# Altium schematic sheet 1.4.SchDoc
size A3; SheetNumber: 4
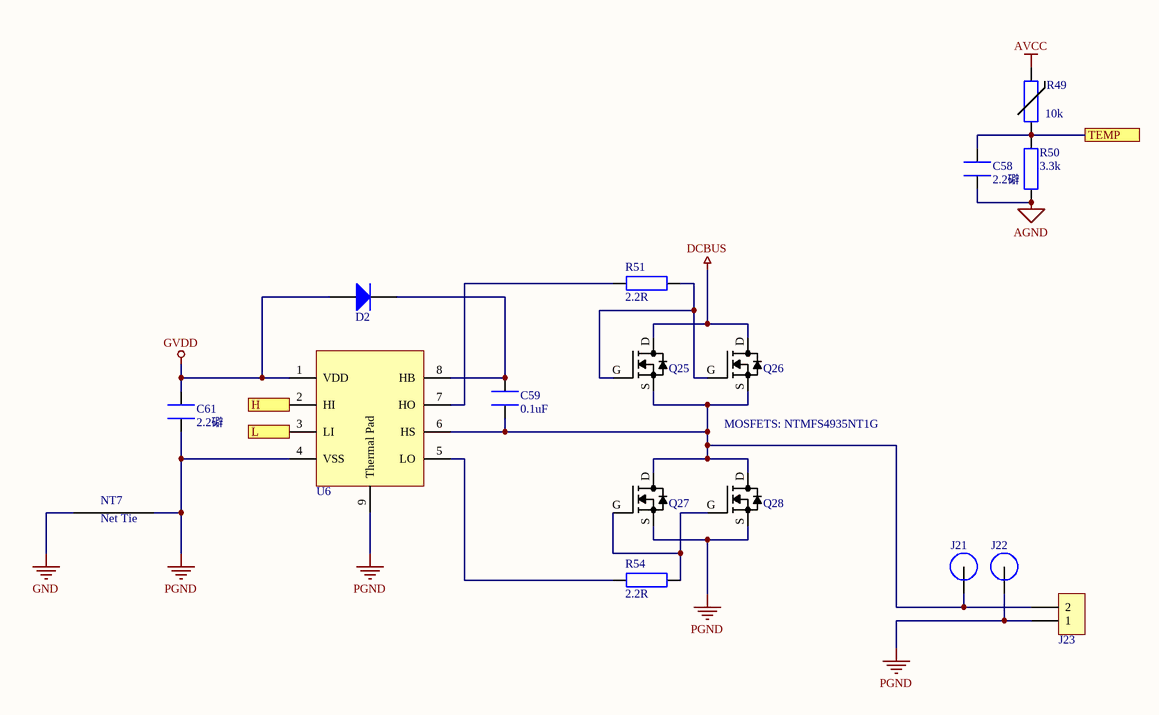
[diagram p0: 1.4.SchDoc]

## Parts
C58  2.2礔  [CAPC1608X09L]
C59  0.1uF  [CAPC1608X09L]
C61  2.2礔  [CAPC1608X09L]
D2  (no value)  [DIOM2717X10N]
J21  (no value)  [M3 Spade Hole]
J22  (no value)  [M3 Spade Hole]
J23  1868076  [1868076]  (value not drawn)
NT7  0.25mm  [NetTie_0.25mm]  (value not drawn)  (net tie, no BOM)
Q25  FILL_FOOTPRINT  [SO8FL_FILL]  (value not drawn)
Q26  (no value)  [SO8FL]
Q27  (no value)  [SO8FL]
Q28  (no value)  [SO8FL]
R49  10k  [RESC1005X40N]
R50  3.3k  [RESC1608X55N]
R51  2.2R  [RESC1608X55N]
R54  2.2R  [RESC1608X55N]
U6  (no value)  [SON80P400X80_HS-9N]

## Ports
H, L, TEMP

## Nets
AGND: C58.1 R50.2
AVCC: R49.2
DCBUS: Q25.D Q26.D
GND: NT7.1
GVDD: C61.2 D2.A U6.1(VDD)
PGND: C61.1 J22.1 J23.1 NT7.2 Q27.S Q28.S U6.4(VSS) U6.9(Thermal_Pad)
H: U6.2(HI) ; port H
L: U6.3(LI) ; port L
TEMP: C58.2 R49.1 R50.1 ; port TEMP
NetC59_1: C59.1 D2.K U6.8(HB)
NetC59_2: C59.2 J21.1 J23.2 Q25.S Q26.S Q27.D Q28.D U6.6(HS)
NetQ25_G: Q25.G Q26.G R51.2
NetQ27_G: Q27.G Q28.G R54.2
NetR51_1: R51.1 U6.7(HO)
NetR54_1: R54.1 U6.5(LO)

## Notes on the sheet
- MOSFETS: NTMFS4935NT1G
- (in symbol NetTie_0.25mm) Net Tie

## Library data of the parts
C58 C61 = GRM188R61C225KE15D: CAP CER 2.2UF 16V X5R 0603; Manufacturer: Murata Electronics North America; Tolerance: ?0%; Supplier 1: Digi-Key; Supplier Part Number 1: 490-3296-1-ND; Manufacturer Part Number: GRM188R61C225KE15D; RoHS: RoHS Compliant; Category: Capacitors; Stock 1: 1255740; Pricing 1: 1=0.12, 10=0.08, 50=0.046, 100=0.038, 250=0.032, 500=0.0268, 1000=0.022 (USD); Packaging: Cut Tape (CT); Capacitance: 2.2礔; Voltage - Rated: 16V; Temperature Coefficient: X5R; Mounting Type: Surface Mount, MLCC; Operating Temperature: -55癈 ~ 85癈; Applications: General Purpose; Ratings: -; Package / Case: 0603 (1608 Metric); Size / Dimension: 0.063" L x 0.031" W (1.60mm x 0.80mm); Height - Seated (Max): -; Thickness (Max): 0.035" (0.90mm); Lead Spacing: -; Features: -; Lead Style: -; ComponentLink1URL: http://www.murata.com/~/media/webrenewal/support/library/catalog/products/capacitor/mlcc/c02e.pdf; ComponentLink1Description: http://www.murata.com/~/media/webrenewal/support/library/catalog/products/capacitor/mlcc/c02e.pdf
C59 = GRM188R71H104KA93D: CAP CER 0.1UF 50V X7R 0603; Manufacturer: Murata Electronics North America; Tolerance: ?0%; Supplier 1: Digi-Key; Supplier Part Number 1: 490-1519-2-ND; Manufacturer Part Number: GRM188R71H104KA93D; RoHS: RoHS Compliant; Category: Capacitors; Pricing 1: 4000=0.01822, 8000=0.01663, 12000=0.01584 (USD); Packaging: Tape & Reel (TR); Capacitance: 0.1uF; Voltage - Rated: 50V; Temperature Coefficient: X7R; Mounting Type: Surface Mount, MLCC; Operating Temperature: -55癈 ~ 125癈; Applications: General Purpose; Ratings: -; Package / Case: 0603 (1608 Metric); Size / Dimension: 0.063" L x 0.032" W (1.60mm x 0.80mm); Height - Seated (Max): -; Thickness (Max): 0.035" (0.90mm); Lead Spacing: -; Features: -; Lead Style: -; ComponentLink1URL: http://www.murata.com/~/media/webrenewal/support/library/catalog/products/capacitor/mlcc/c02e.ashx?la=en-us; ComponentLink1Description: http://www.murata.com/~/media/webrenewal/support/library/catalog/products/capacitor/mlcc/c02e.ashx?la=en-us; Stock: 19812000; Part Status: Active; Supplier 2: Digi-Key; Supplier Part Number 2: 490-1519-1-ND; Pricing 2: 1=0.12, 10=0.084, 100=0.0396, 500=0.02778, 1000=0.023 (USD)
D2 = MBR140SFT1G: Rectifier Diode, Single, 40 V, 1 A, SOD-123FL, 2, 550 mV
J21 J22 = M3 Spade Terminal
J23 = 1868076: CONN TERM BLOCK 2POS 7.62MM; Manufacturer: Phoenix Contact; Number of Levels: 1; Positions Per Level: 2; Pitch: 0.300" (7.62mm); Mating Orientation: Horizontal with Board; Current: 30A; Voltage: 300V; Wire Gauge: 10-30 AWG; Wire Termination: Screw - Rising Cage Clamp; Torque - Screw: 0.5-0.6 Nm (4.4-5.3 Lb-In); Screw Thread: M3; Supplier 1: Digi-Key; Supplier Part Number 1: 277-5840-ND; RoHS: RoHS Compliant; Category: Connectors, Interconnects; Stock: 2175; Pricing 1: 1=1.56, 10=1.517, 50=1.4178, 100=1.3044, 250=1.20512, 500=1.14842, 1000=1.0564 (USD); Packaging: Bulk; Part Status: Active; Mounting Type: Through Hole; Features: Interlocking (Side); Color: Green; Operating Temperature: -; Housing Material: Polyamide (PA), Nylon; Contact Material - Plating: -; Clamp Material - Plating: -; Screw Material - Plating: -; ComponentLink1URL: http://media.digikey.com/PDF/Data%20Sheets/Phoenix%20Contact%20PDFs/1868076.pdf; ComponentLink1Description: http://media.digikey.com/PDF/Data%20Sheets/Phoenix%20Contact%20PDFs/1868076.pdf
NT7 = NetTie_0.25mm
Q25-Q28 = NTMFS4935NT1G: MOSFET N-CH 30V 13A SO8FL; Manufacturer: ON Semiconductor; FET Type: N-Channel; Current - Continuous Drain (Id) @ 25癈: 13A (Ta), 93A (Tc); Drive Voltage (Max Rds On,  Min Rds On): 4.5V, 10V; Vgs(th) (Max) @ Id: 2.2V @ 250礎; Gate Charge (Qg) (Max) @ Vgs: 49.4nC @ 10V; Input Capacitance (Ciss) (Max) @ Vds: 4850pF @ 15V; Vgs (Max): ?0V; Power Dissipation (Max): 930mW (Ta), 48W (Tc); Rds On (Max) @ Id, Vgs: 3.2 mOhm @ 30A, 10V; Supplier 1: Digi-Key; Supplier Part Number 1: NTMFS4935NT1GOSCT-ND; RoHS: RoHS Compliant; Category: Discrete Semiconductor Products; Stock 1: 932; Pricing 1: 1=0.61, 10=0.541, 100=0.4145, 500=0.3277 (USD); Packaging: Cut Tape (CT); Part Status: Active; Technology: MOSFET (Metal Oxide); Drain to Source Voltage (Vdss): 30V; FET Feature: -; Operating Temperature: -55癈 ~ 150癈 (TJ); Mounting Type: Surface Mount; Supplier Device Package: 5-DFN (5x6) (8-SOFL); Package / Case: 8-PowerTDFN, 5 Leads; ComponentLink1URL: http://www.onsemi.com/pub_link/Collateral/NTMFS4935N-D.PDF; ComponentLink1Description: http://www.onsemi.com/pub_link/Collateral/NTMFS4935N-D.PDF; Manufacturer Part Number: NTMFS4935NT1G
R49 = NCP15XH103F03RC: THERMISTOR 10K OHM NTC 0402 SMD; Value: 10k
R50 = RC0603FR-073K3L: RES SMD 3.3K OHM 1% 1/10W 0603; Manufacturer: Yageo; Tolerance: ?%; Power (Watts): 0.1W, 1/10W; Temperature Coefficient: ?00ppm/癈; Supplier 1: Digi-Key; Supplier Part Number 1: 311-3.30KHRCT-ND; Manufacturer Part Number: RC0603FR-073K3L; RoHS: RoHS Compliant; Category: Resistors; Stock 1: 420019; Pricing 1: 1=0.1, 10=0.014, 25=0.01, 100=0.0057, 250=0.00436, 500=0.00348, 1000=0.00257, 2500=0.00223 (USD); Packaging: Cut Tape (CT); Resistance (Ohms): 3.3k; Composition: Thick Film; Features: Moisture Resistant; Operating Temperature: -55癈 ~ 155癈; Package / Case: 0603 (1608 Metric); Supplier Device Package: 0603; Size / Dimension: 0.063" L x 0.031" W (1.60mm x 0.80mm); Height: 0.022" (0.55mm); Number of Terminations: 2; ComponentLink1URL: http://www.yageo.com/documents/recent/PYu-RC_Group_51_RoHS_L_04.pdf; ComponentLink1Description: http://www.yageo.com/documents/recent/PYu-RC_Group_51_RoHS_L_04.pdf
R51 R54 = RC0603FR-072R2L: RES SMD 2.2 OHM 1% 1/10W 0603; Manufacturer: Yageo; Resistance (Ohms): 2.2; Tolerance: ?%; Power (Watts): 0.1W, 1/10W; Temperature Coefficient: ?00ppm/癈; Supplier 1: Digi-Key; Supplier Part Number 1: 311-2.2HRCT-ND; Manufacturer Part Number: RC0603FR-072R2L; RoHS: RoHS Compliant; Category: Resistors; Stock 1: 16531; Pricing 1: 1=0.1, 10=0.02, 25=0.0144, 100=0.0082, 250=0.00624, 500=0.00498, 1000=0.00367, 2500=0.00319 (USD); Packaging: Cut Tape (CT); Composition: Thick Film; Features: Moisture Resistant; Operating Temperature: -55癈 ~ 155癈; Package / Case: 0603 (1608 Metric); Supplier Device Package: 0603; Size / Dimension: 0.063" L x 0.031" W (1.60mm x 0.80mm); Height: 0.022" (0.55mm); Number of Terminations: 2; ComponentLink1URL: http://www.yageo.com/documents/recent/PYu-RC_Group_51_RoHS_L_04.pdf; ComponentLink1Description: http://www.yageo.com/documents/recent/PYu-RC_Group_51_RoHS_L_04.pdf
U6 = LM5109BSD/NOPB: DRIVER, MOSFET, HALF BRIDGE, WSON-8, 1A; Supplier 1: Farnell; Supplier Part Number 1: 2400642RL; Supplier 2: Farnell; Supplier Part Number 2: 2400642; Supplier 3: Farnell; Supplier Part Number 3: 2382850